# EAGLE schematic test_add_res_2 (EAGLE 6.4)
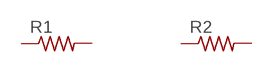
[diagram p0: schematic, sheet 1]

## Parts
R1  R-US_R0805  [R0805]
R2  R-US_R0805  [R0805]
Unconnected: R1.1 R1.2 R2.1 R2.2

## Library data of the parts
R1 R2 = rcl:R-US_: RESISTOR, American symbol